# EAGLE design GDEnvSensorNode_1_4h (EAGLE 9.2.0)
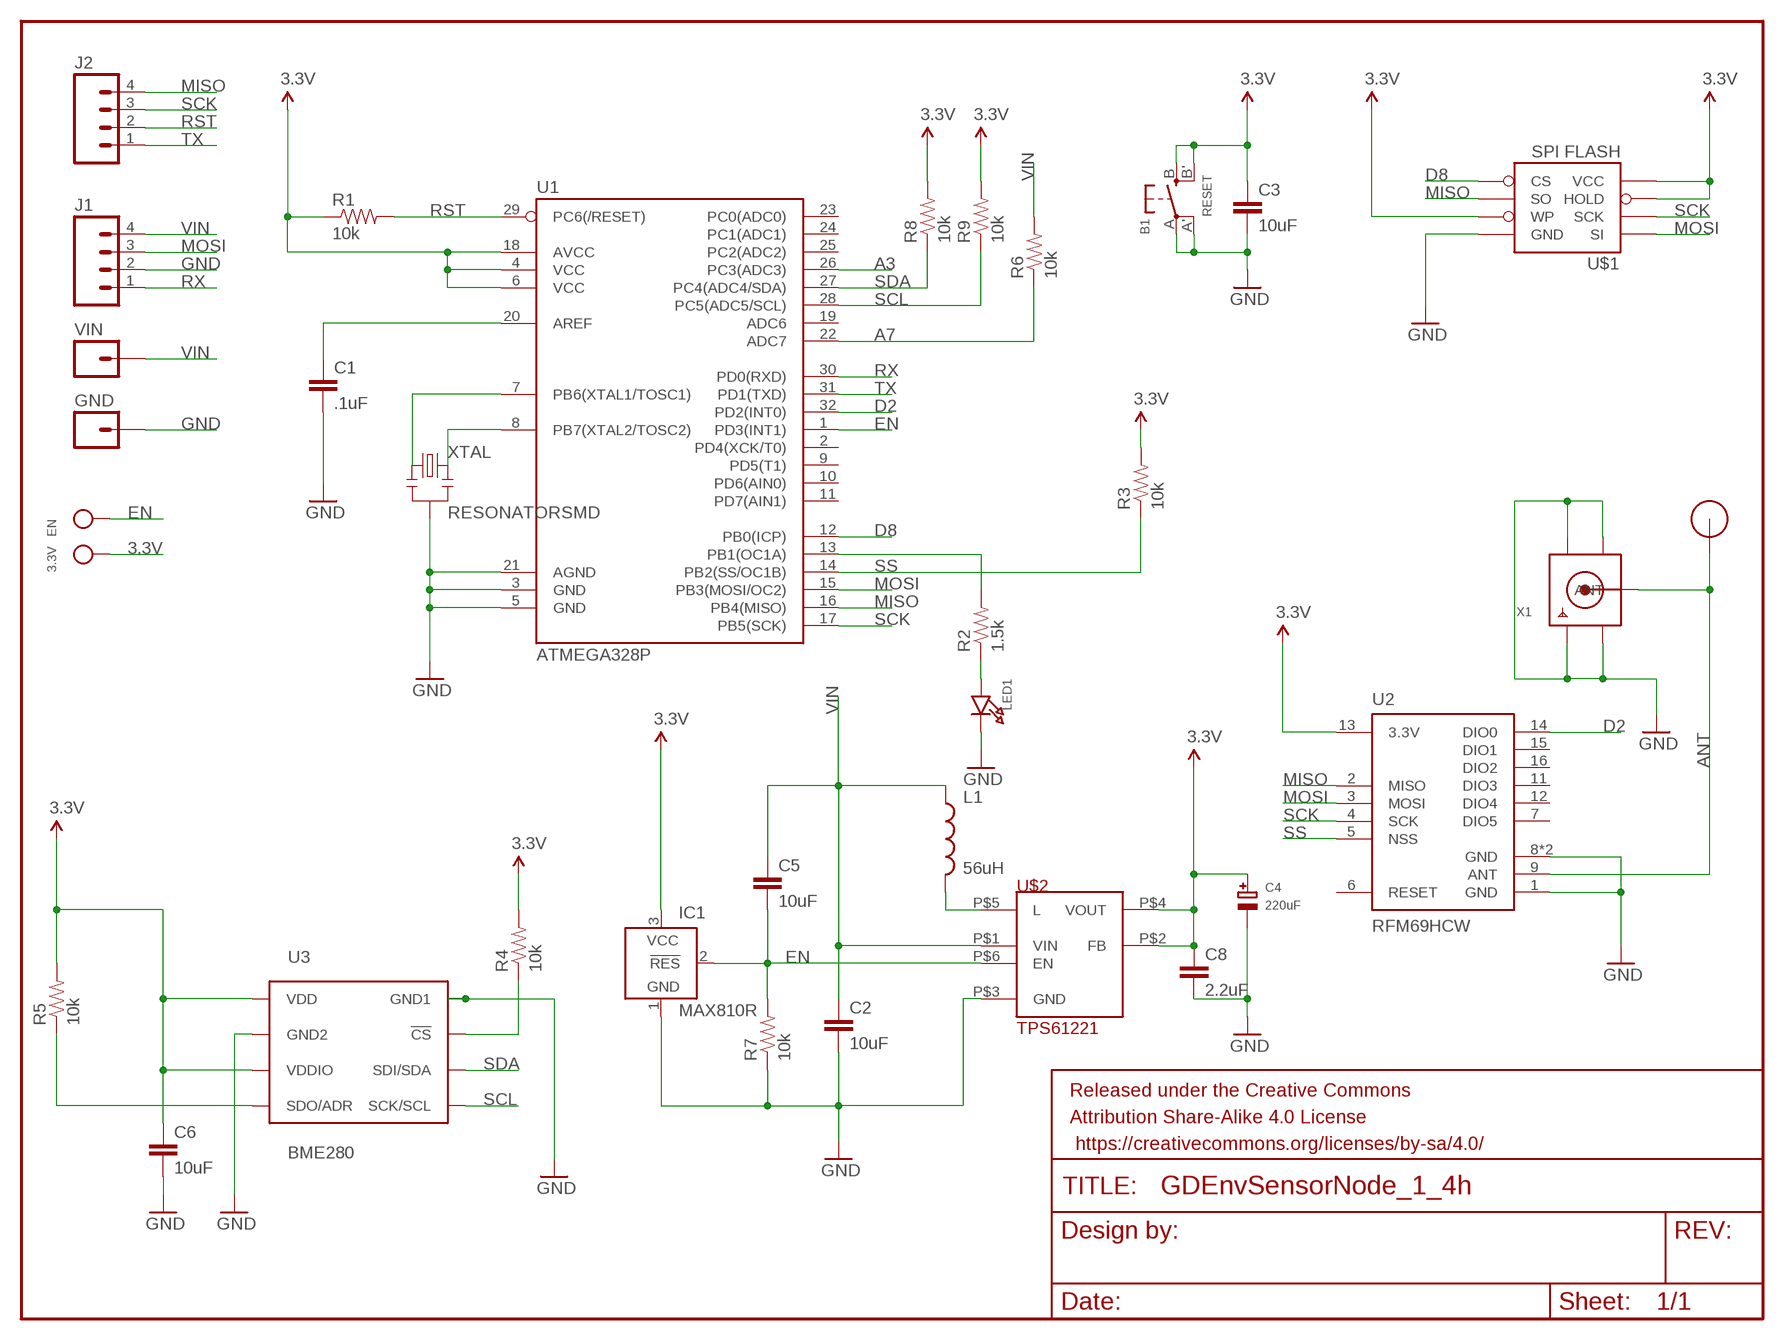
[diagram p0: schematic, sheet 1]

## Parts
3.3V  TESTPOINTROUND1MM  [TESTPOINT_ROUND_1MM]
B1  RESET  SWITCH_TACT_SMT4.6X2.8  [BTN_KMR2_4.6X2.8]
C1  .1uF  CAP0805  [0805]
C2  10uF  CAP0805  [0805]
C3  10uF  CAP0805  [0805]
C4  220uF  CAP_TANTALUMD/7343_REFLOW  [EIA7343-31/D-R]
C5  10uF  CAP0805  [0805]
C6  10uF  CAP0805  [0805]
C8  2.2uF  CAP0805  [0805]
EN  TESTPOINTROUND1MM  [TESTPOINT_ROUND_1MM]
FRAME1  FRAME-LETTER  [CREATIVE_COMMONS]
GND  M01PTH_2MM  [1X01_2MM]
IC1  MAX810R  TCM809  [SOT23B-3]
J1  M04PTH  [1X04]
J2  M04PTH  [1X04]
L1  56uH  INDUCTOR3MM  [3MM]
LED1  LED0805  [CHIPLED_0805]
R1  10k  RESISTOR0805-RES  [0805]
R2  1.5k  RESISTOR0805-RES  [0805]
R3  10k  RESISTOR0805-RES  [0805]
R4  10k  RESISTOR0805-RES  [0805]
R5  10k  RESISTOR0805-RES  [0805]
R6  10k  RESISTOR0805-RES  [0805]
R7  10k  RESISTOR0805-RES  [0805]
R8  10k  RESISTOR0805-RES  [0805]
R9  10k  RESISTOR0805-RES  [0805]
U1  ATMEGA328P  ATMEGA328P_TQFP  [TQFP32-08]
U2  RFM69HCW  [RFM69HCW-XXXS2]
U3  BME280  [BME280_LGA]
U$1  SPI FLASH  AT25F512BJEDEC_3.9MM  [SO08]
U$2  TPS61221  [TPS61221]
U$4  RFM12B_ANTENNA  [RFM12B-ANTENNA]
VIN  M01PTH_2MM  [1X01_2MM]
X1  SMACONNECTOR_EDGE_UFL  [SMA_EDGELAUNCH_UFL]
XTAL  RESONATORSMD  [RESONATOR-SMD]

## Nets
3.3V: 3.3V.P$1 B1.B'(S1) B1.B(S) C3.1 C4.+ C6.1 C8.1 IC1.3(VCC) R1.1 R3.2 R4.2 R5.2 R8.2 R9.2 U1.4(VCC) U1.6(VCC) U1.18(AVCC) U2.13(3.3V) U3.P$6(VDDIO) U3.P$8(VDD) U$1.3_WP(WP) U$1.7_HOLD(HOLD) U$1.8_VCC(VCC) U$2.P$2(FB) U$2.P$4(VOUT)
A3: U1.26(PC3(ADC3))
A7: R6.1 U1.22(ADC7)
ANT: U2.9(ANT) U$4.P$1 X1.P(ANT)
D2: U1.32(PD2(INT0)) U2.14(DIO0)
D8: U1.12(PB0(ICP)) U$1.1_CS(CS)
EN: C5.2 EN.P$1 IC1.2(!RES) R7.2 U1.1(PD3(INT1)) U$2.P$6(EN)
GND: B1.A'(P1) B1.A(P) C1.2 C2.2 C3.2 C4.- C6.2 C8.2 GND.1 IC1.1(GND) J1.2 LED1.C R7.1 U1.3(GND) U1.5(GND) U1.21(AGND) U2.1(GND) U2.8(GND) U2.10(GND) U3.P$1(GND1) U3.P$7(GND2) U$1.4_GND(GND) U$2.P$3(GND) X1.GND@1(GND1) X1.GND@2(GND2) X1.GND@3(GND3) X1.GND@4(GND4) XTAL.2
L: L1.P$2 U$2.P$5(L)
MISO: J2.4 U1.16(PB4(MISO)) U2.2(MISO) U$1.2_SO(SO)
MOSI: J1.3 U1.15(PB3(MOSI/OC2)) U2.3(MOSI) U$1.5_SI(SI)
N$1: U1.8(PB7(XTAL2/TOSC2)) XTAL.3
N$2: U1.7(PB6(XTAL1/TOSC1)) XTAL.1
N$3: LED1.A R2.1
N$5: R4.1 U3.P$2(!CS)
N$8: R2.2 U1.13(PB1(OC1A))
N$13: C1.1 U1.20(AREF)
N$17: R5.1 U3.P$5(SDO/ADR)
RST: J2.2 R1.2 U1.29(PC6(/RESET))
RX: J1.1 U1.30(PD0(RXD))
SCK: J2.3 U1.17(PB5(SCK)) U2.4(SCK) U$1.6_SCK(SCK)
SCL: R9.1 U1.28(PC5(ADC5/SCL)) U3.P$4(SCK/SCL)
SDA: R8.1 U1.27(PC4(ADC4/SDA)) U3.P$3(SDI/SDA)
SS: R3.1 U1.14(PB2(SS/OC1B)) U2.5(NSS)
TX: J2.1 U1.31(PD1(TXD))
VIN: C2.1 C5.1 J1.4 L1.P$1 R6.2 U$2.P$1(VIN) VIN.1
Unconnected: U1.2(PD4(XCK/T0)) U1.9(PD5(T1)) U1.10(PD6(AIN0)) U1.11(PD7(AIN1)) U1.19(ADC6) U1.23(PC0(ADC0)) U1.24(PC1(ADC1)) U1.25(PC2(ADC2)) U2.6(RESET) U2.7(DIO5) U2.11(DIO3) U2.12(DIO4) U2.15(DIO1) U2.16(DIO2)

## Library data of the parts
3.3V EN = microbuilder:TESTPOINT: Test Point Various test points for characterisation and PCB testing TESTPOINT_SMT - Compact Surface Mount Test Point [Digikey: 5016KTR-ND]
B1 = microbuilder:SWITCH_TACT_SMT: SMT Tact Switches 6x6mm - Digikey: P12940SCT-ND KMR2 (4.6x2.8mm) - Digikey: 401-1426-1-ND EVQ-PQHB55 - Light Touch, 160GF (4.5x4.5mm) - Digikey: P8090SCT-ND
C1-C3 C5 C6 C8 = SparkFun-Capacitors:CAP: Capacitor Standard 0603 ceramic capacitor, and 0.1" leaded capacitor.
C4 = GDTech:CAP_TANTALUM: Tantalum Capacitors Wave footprints have larger pads and are meant to be used for hand soldering. Reflow footprints are optimised for solder paste and a reflow oven. EIA3216-18/A-[R/W] - Size A / 3216-18 / 1206 footprint 4.7µF 25V 10% Tantalum Capacitor 10µF 16V 10% Tantalum Capacitor [Digikey: 495-2236-2-ND] EIA3528-21/B-[R/W] - Size B / 3528-21 47µF 10V 10% Tantalum Capactior [Digikey: 495-2216-1-ND] EIA6032-28/C-[R/W] - Size C / 6032-28 10µF 35V 20% Tantalum Capacitor [Digikey: 495-2285-1-ND] 100µF 16V 10% Tantalum Capactior [Digikey: 399-5214-1-ND]
FRAME1 = SparkFun-Aesthetics:FRAME-LETTER: Schematic Frame Standard 8.5x11 US Letter frame
GND VIN = SparkFun-Connectors:M01: Header 1 Standard 1-pin 0.1" header. Use with straight break away headers (SKU : PRT-00116), right angle break away headers (PRT-00553), swiss pins (PRT-00743), machine pins (PRT-00117), and female headers (PRT-00115). SMTSO-256-ET is a "flush mount" nut for a 4-40 screw. The older package used to be too tight, and did not allow it to sit properly thru the drill hit. The latest (0.165DIA) fits nice and snug.
IC1 = telcom:TCM809: POWER SUPPLY MONITOR replacement for Maxim MAX809 and MAX810; MF: MICROCHIP; MPN: TCM809MENB713; OC_FARNELL: 9762744; OC_NEWARK: 96K3998
J1 J2 = SparkFun-Connectors:M04: Header 4 Standard 4-pin 0.1" header. Use with straight break away headers (SKU : PRT-00116), right angle break away headers (PRT-00553), swiss pins (PRT-00743), machine pins (PRT-00117), and female headers (PRT-00115). Molex polarized connector foot print use with SKU : PRT-08231 with associated crimp pins and housings. 1MM SMD Version SKU: PRT-10208; PROD_ID: CONN-09696
L1 = GDTech:INDUCTOR: Inductors Basic Inductor/Choke - 0603 and 1206. Footprints are not proven and vary greatly between part numbers. INDUCTOR POWER 3.3UH 4.0A SMD 0.197" L x 0.197" W x 0.177" H (5.00mm x 5.00mm x 4.50mm)
LED1 = microbuilder:LED: LED 0603 - 0603 Surface Mount Package 2mA: Green LED - Low Power (3.9mcd, 2ma, 1.7Vf) - Digikey: 475-2709-2-ND Orange LED - Low Power (9.8mcd, 2ma, 1.8Vf) - Digikey: 475-1194-2-ND Red LED - Low Power (5mcd, 2ma, 1.8Vf) - Digikey: 475-1195-2-ND Yellow LED - Low Power (7mcd, 2ma, 1.8Vf) - Digikey: 475-1196-2-ND 5mA: Blue LED - Low Power (17mcd, 5ma, 2.9Vf) - Digikey: LNJ937W8CRACT-ND 0805 - 0805 Surface Mount Package 2mA: Red LED (8.8mcd, 2mA, 1.8Vf, Clear) - Low Power [Digikey: 475-2510-1-ND] Green LED (5mcd, 2mA, 1.8Vf, Clear) - Low Power [Digikey: 475-2730-1-ND] Yellow LED (11.3mcd, 2mA, 1.8Vf, Clear) - Low Power [Digikey: 475-2555-1-ND] 20mA: Red LED (104mcd, 20mA, Diffused) - LS R976 [Digikey: 475-1278-6-ND] Red LED (12mcd, 20mA, 2.0Vf, Clear) - APT2012EC [Digikey: 754-1128-1-ND] Green LED (15mcd, 20mA, 2.2Vf, Clear) - APT2012GC [Digikey: 754-1131-1-ND] Orange LED (160mcd, 20mA, 2.1Vf, Clear) - APT2012SECK [Digikey: 754-1130-1-ND] 1206 - 1206 Surface Mount Package Green LED (26mcd, 20mA, Diffused) - LG N971 [Digikey: 475-1407-6-ND] Red LED (15mcd, 20mA, Diffused) - LH N974 [Digikey: 475-1416-6-ND]
R1-R9 = SparkFun-Passives:RESISTOR: Resistor Basic schematic elements and footprints for 0603, 1206, and PTH resistors.
U1 = SparkFun-DigitalIC:ATMEGA328P_TQFP; PROD_ID: IC-09069; VALUE: ATMEGA328P_TQFP
U2 = SparkFun-RF:RFM69H; PROD_ID: IC-11997, IC-12053
U3 = BME280ComponentLibrary:BME280; PROD_ID: IC-13090
U$1 = LowPowerLab:AT25F512B: 4-Mbit SPI flash memory
U$2 = GDTech:TPS61221; AVAILABILITY: Unavailable; DESCRIPTION: the tps6122x family devices provide a power-supply solution for products powered by either a single-cell two-cell or ...; MF: Texas Instruments; MP: TPS61221; PACKAGE: SC-70 Texas Instruments; PRICE: None
U$4 = LowPowerLab:RFM12B_ANTENNA
X1 = adafruit:SMACONNECTOR: SMA Connector 90° DIP SMA Connector, 50 Ohm (4UConnector: 07259)
XTAL = GDTech:RESONATOR: Resonator Small SMD resonator. This is the itty bitty 10/20MHz resonators with built in caps. CSTCE10M0G55 and CSTCE20M0V53. Footprint has been reviewed closely but hasn't been tested yet.

## Board
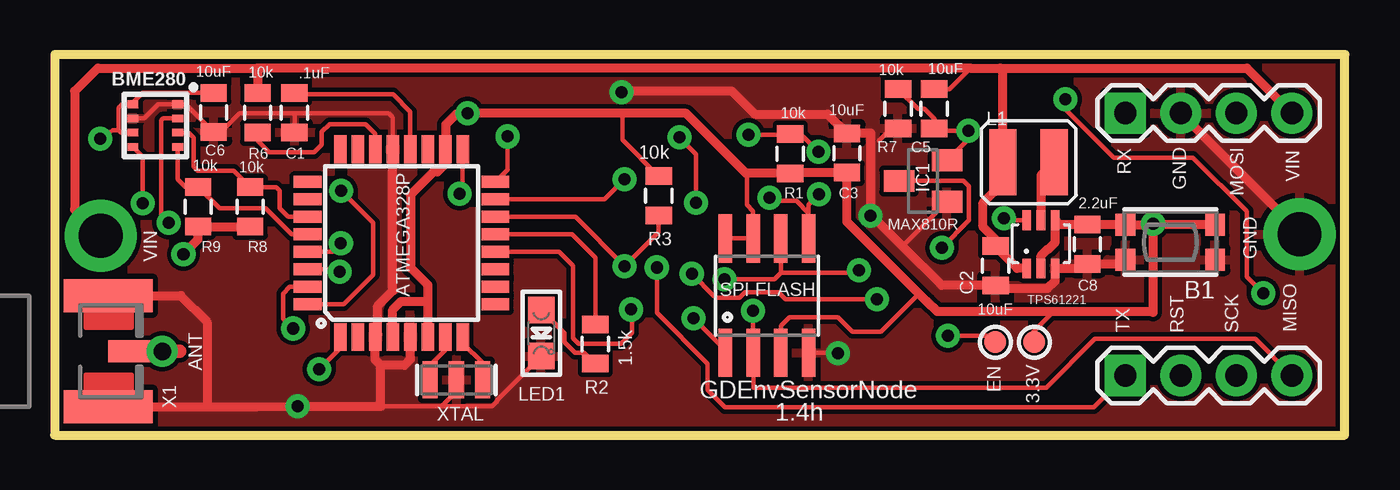
[diagram p1: board, top side]
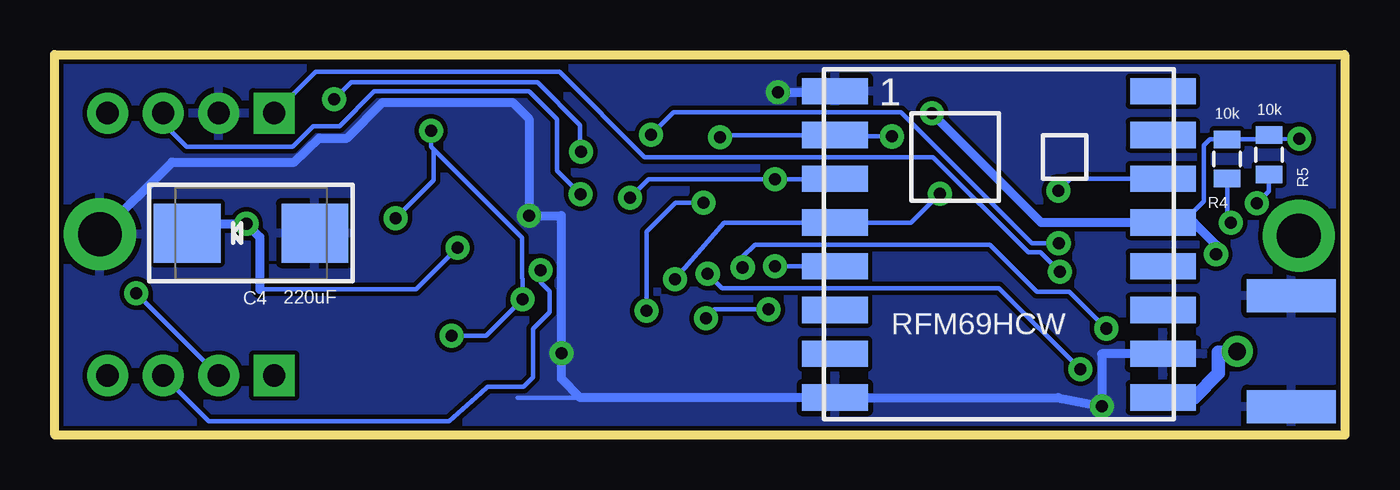
[diagram p2: board, bottom side, seen from below]

Size 59.01 x 17.4 mm. Coordinates in mm from the lower left corner, seen from the top.
Outline: 0,0 59,0 59.01,17.4 0.01,17.4 0,0
Copper layers (1*16): Top 0.035mm / dielectric 1.5mm / Bottom 0.035mm
Design rules "SparkFun *": minimum track width 8mil, minimum drill 20mil, track to track 8mil, track to pad 8mil, pad to pad 8mil, via to via 8mil, smd to smd 8mil, copper to edge 8mil, drill to drill 8mil, minimum pad ring 12mil, minimum via ring 10mil, stop-mask expansion 4mil, vias tented up to drill 22mil, thermal gap 10mil

### Footprints (pad centres in the part's own frame; a part is rotated, then mirrored left to right if it is on the bottom)
TESTPOINT_ROUND_1MM = smd 1 x 1: P$1 0,0
BTN_KMR2_4.6X2.8 = smd 0.9 x 1: A 2.05,0.8; A' -2.05,0.8; B 2.05,-0.8; B' -2.05,-0.8
0805 = smd 0.8 x 1.2: 1 -0.9,0; 2 0.9,0
EIA7343-31/D-R = smd 3.048 x 2.7: + 2.921,0; - -2.921,0
1X01_2MM = drill 2 pad 3.302: 1 0,0
SOT23B-3 = smd 1 x 1.4: 1 -0.95,-1.1; 2 0.95,-1.1; 3 0,1.1
1X04 = drill 1.016 pad 1.88 square: 1 0,0 | drill 1.016 pad 1.88: 2 2.54,0; 3 5.08,0; 4 7.62,0
3MM = smd 1.25 x 3: P$1 -1.17,0; P$2 1.17,0
CHIPLED_0805 = smd 1.2 x 1.2: A 0,-1.05; C 0,1.05
TQFP32-08 = smd 1.27 x 0.559: 1 -4.293,2.8; 2 -4.293,2; 3 -4.293,1.2; 4 -4.293,0.4; 5 -4.293,-0.4; 6 -4.293,-1.2; 7 -4.293,-2; 8 -4.293,-2.8; 17 4.293,-2.8; 18 4.293,-2; 19 4.293,-1.2; 20 4.293,-0.4; 21 4.293,0.4; 22 4.293,1.2; 23 4.293,2; 24 4.293,2.8 | smd 0.559 x 1.27: 9 -2.8,-4.293; 10 -2,-4.293; 11 -1.2,-4.293; 12 -0.4,-4.293; 13 0.4,-4.293; 14 1.2,-4.293; 15 2,-4.293; 16 2.8,-4.293; 25 2.8,4.293; 26 2,4.293; 27 1.2,4.293; 28 0.4,4.293; 29 -0.4,4.293; 30 -1.2,4.293; 31 -2,4.293; 32 -2.8,4.293
RFM69HCW-XXXS2 = smd 3 x 1.2: 1 -7.5,7; 2 -7.5,5; 3 -7.5,3; 4 -7.5,1; 5 -7.5,-1; 6 -7.5,-3; 7 -7.5,-5; 8 -7.5,-7; 9 7.5,-7; 10 7.5,-5; 11 7.5,-3; 12 7.5,-1; 13 7.5,1; 14 7.5,3; 15 7.5,5; 16 7.5,7
BME280_LGA = smd 0.5 x 0.35: P$1 1.025,0.975; P$2 1.025,0.325; P$3 1.025,-0.325; P$4 1.025,-0.975; P$5 -1.025,-0.975; P$6 -1.025,-0.325; P$7 -1.025,0.325; P$8 -1.025,0.975
SO08 = smd 0.61 x 2.21: 1_CS -1.905,-2.616; 2_SO -0.635,-2.616; 3_WP 0.635,-2.616; 4_GND 1.905,-2.616; 5_SI 1.905,2.616; 6_SCK 0.635,2.616; 7_HOLD -0.635,2.616; 8_VCC -1.905,2.616
TPS61221 = smd 0.9 x 0.4: P$1 0,0; P$2 0,-0.65; P$3 0,-1.3; P$4 2.2,-1.3; P$5 2.2,-0.65; P$6 2.2,0
RFM12B-ANTENNA = drill 0.8 pad 1.422: P$1 0,0
SMA_EDGELAUNCH_UFL = smd 4.064 x 1.524: GND@1 2.032,-2.54; GND@2 2.032,2.54 | smd 4.064 x 1.524 bottom: GND@3 2.032,2.54; GND@4 2.032,-2.54 | smd 2.032 x 1.016: P 3.048,0
RESONATOR-SMD = smd 0.7 x 1.7: 1 -1.2,0; 2 0,0; 3 1.2,0

### Placement (x,y rotation side)
3.3V  44.8,4.26 0 top
B1  51.02,8.83 180 top
C1  10.97,14.74 270 top
C2  43.03,7.75 270 top
C3  36.23,12.9 90 top
C4  50.03,9.24 180 bottom
C5  40.23,14.93 270 top
C6  7.27,14.76 270 top
C8  47.23,8.74 270 top
EN  43.02,4.26 0 top
FRAME1  21.56,-9.71 0 top  (outside the outline)
GND  56.94,9.19 0 top
IC1  39.72,11.63 90 top
J1  48.97,14.73 0 top
J2  48.97,2.73 0 top
L1  44.54,12.48 0 top
LED1  22.26,4.67 180 top
R1  33.64,12.87 90 top
R2  24.73,4.17 90 top
R3  27.63,10.95 90 top
R4  5.38,12.63 90 bottom
R5  3.47,12.82 90 bottom
R6  9.28,14.74 90 top
R7  38.58,14.93 90 top
R8  8.94,10.44 270 top
R9  6.56,10.45 270 top
U1  15.87,8.79 90 top
U2  15.82,8.72 0 bottom
U3  4.6,14.16 0 top
U$1  32.58,6.38 0 top
U$2  44.46,7.63 90 top
U$4  4.92,3.84 270 top
VIN  2.11,9.12 0 top
X1  0.41,3.84 0 top
XTAL  18.37,2.53 0 top

### Tracks (layer width: path | path; a pad name or v marks a point on that pad's centre or on a via)
3.3V  (via drill 0.55 pad 1.1)
  Top 0.203: U3.P$8 3.51,15.13 | 3.51,15.13 3.09,15.13 2.93,14.98 2.93,13.95 | 2.93,13.95 3.05,13.83 3.06,13.83 U3.P$6 | C6.1 4.03,15.66 3.51,15.13 | v2.09,13.55 2.65,13.95 2.93,13.95 | U$1.8_VCC U$1.7_HOLD 31.95,10.24 31.66,10.53 31.66,11.94 31.62,11.97 | R3.2 25.97,13.51 25.97,14.72 | U$1.3_WP 33.21,5.01 33.6,5.4 35.82,5.4 36.48,4.74 37.79,4.74 39.52,6.47 | 3.3V.P$1 44.77,4.26 44.77,4.73 45.69,5.65 | IC1.3 41.57,11.63 41.83,11.37 41.83,9.83 v40.58,8.58
  Top 0.406: U$2.P$2 45.11,8.21 45.39,8.49 45.42,8.49 45.76,8.83 U$2.P$4 45.95,9.64 C8.1 B1.B 50.2,9.63 v50.24,9.67 | v50.24,9.67 50.24,5.61 50.2,5.65 45.69,5.65 40.37,5.65 39.9,6.11 | 39.9,6.11 39.52,6.47 | 17.06,6.09 U1.6 | U1.4 15.46,5.73 15.85,6.12 17.03,6.12 17.06,6.09 | 17.06,6.09 17.06,6.87 16.28,7.65 16.28,10.99 17.33,12.04 17.51,12.04 17.86,12.39 U1.18 17.89,13.1 17.89,14.2 18.41,14.72 v18.88,14.72 25.97,14.72 28.88,14.72 31.62,11.97 R1.1 33.67,12 C3.1 36.23,9.77 39.9,6.11 | v5.89,8.28 6.56,8.95 R9.2 R8.2 | B1.B' 50.28,9.63 v50.24,9.67
  Bottom 0.203: U2.13 7.43,9.72 6.46,10.7 6.46,13.25 6.18,13.53 R4.2 3.48,13.53 | 3.48,13.53 R5.2 | 3.48,13.53 v2.09,13.55 | 49.63,6.67 42.48,6.67 v40.58,8.58
  Bottom 0.406: v18.88,14.72 13.88,9.72 U2.13 6.9,9.72 5.87,8.69 5.87,8.3 v5.89,8.28 | C4.+ 52.52,9.67 v50.24,9.67 49.63,9.06 49.63,6.67
A7
  Top 0.203: U1.22 14.67,13.79 14.23,14.23 12.57,14.23 12.22,13.88 12.22,13.28 11.87,12.93 9.82,12.93 9.28,13.47 R6.1
ANT
  Top 0.61: X1.P 5.72,3.84 U$4.P$1
  Bottom 0.61: U2.9 6.89,1.73 5.78,2.84 5.78,3.79 U$4.P$1
D2  (via drill 0.55 pad 1.1)
  Top 0.203: v13.11,11.18 14.57,9.72 14.57,7.33 13.22,5.98 U1.32
  Bottom 0.203: U2.14 12.57,11.72 v13.11,11.18
D8  (via drill 0.55 pad 1.1)
  Top 0.203: U1.12 23.07,8.38 23.72,7.74 23.72,4.43 23.97,4.18 25.91,4.18 26.41,4.68 26.41,5.7 v26.36,5.75 | v29.22,5.35 30.67,3.9 U$1.1_CS
  Bottom 0.203: v26.36,5.75 28.82,5.75 v29.22,5.35
EN  (via drill 0.55 pad 1.1)
  Top 0.203: U1.1 13.07,3.98 v12.1,3.01 | v29.14,7.38 30.15,6.36 30.2,6.36 30.29,6.28 31.31,6.28 31.58,6.54 33.1,6.54 33.42,6.22 v37.61,6.22 | EN.P$1 42.73,4.55 v40.86,4.55 | U$2.P$6 43.51,9.83 v43.42,9.92 | IC1.2 41.79,13.54 v41.79,13.92 40.34,13.92 C5.2 40.23,14.47 39.77,14.93 39.48,14.93 R7.2
  Bottom 0.203: v12.1,3.01 15.81,6.73 28.49,6.73 v29.14,7.38 | v40.86,4.55 39.28,4.55 v37.61,6.22 37.61,7.16 37.64,7.19 37.64,9.04 41.69,13.09 | v41.79,13.92 41.79,13.19 41.69,13.09 | 41.69,13.09 41.69,11.65 v43.42,9.92
GND  (via drill 0.55 pad 1.1)
  Top 0.203: U3.P$7 4.09,14.48 4.74,15.13 U3.P$1 5.99,15.13 C6.2 7.6,13.86 8.46,14.72 10.97,14.72 | XTAL.2 18.37,2.01 17.69,1.33 | 17.69,1.33 15.61,1.33 14.91,1.32 | LED1.C 20.23,1.59 20.23,1.56 20,1.33 17.69,1.33 | U$1.4_GND 35.81,3.77 v35.83,3.75 | IC1.1 38.78,8.64 | U1.21 15.46,14.54 15.27,14.73 15.26,14.72 10.97,14.72 | C1.2 10.97,14.72 | R7.1 38.26,14.03 37.7,13.47
  Top 0.406: GND.1 56.94,9.29 51.54,14.69 51.54,14.7 J1.2 | U1.5 16.27,3.47 16,3.2 14.91,3.2 | 14.91,3.2 14.66,3.45 14.67,3.46 U1.3 14.78,4.61 14.78,5.91 15.46,6.6 U1.21 | 14.91,3.2 14.9,3.19 14.91,1.32 v11.12,1.32 9.2,1.3 6.97,1.3 | X1.GND@1 6.97,1.3 | X1.GND@2 5.77,6.38 6.97,5.18 6.97,1.3 | v25.92,15.69 25.95,15.72 30.99,15.72 32.02,14.69 35.35,14.69 C3.2 36.24,13.81 37.32,13.81 v37.32,10.04 37.38,10.04 38.78,8.64 40.57,6.85 C2.2 43.15,6.71 45.41,6.71 45.76,7.05 U$2.P$3 47.02,7.63 C8.2 48.78,7.84 B1.A
  Bottom 0.203: 37.83,1.73 34.26,1.73
  Bottom 0.406: U2.10 11.12,3.73 v11.12,1.32 13.12,1.73 U2.8 34.26,1.73 34.97,1.73 35.83,2.58 v35.83,3.75 35.83,10.04 v37.32,10.04 37.32,14.46 38.07,15.21 44.01,15.21 45.64,13.58 46.91,13.58 48.05,12.49 53.64,12.49 GND.1 | v25.92,15.69 23.36,15.69 U2.1
  pour Bottom: 0.06,17.44 59.06,17.44 59,0 0,0
  pour Top: 0.06,17.42 59.06,17.42 59.03,0.02 0.03,0.02
L
  Top 0.406: U$2.P$5 45.11,11.88 L1.P$2
MISO  (via drill 0.55 pad 1.1)
  Top 0.203: U1.16 20.72,12.15 v20.72,13.66 | v28.57,13.62 29.34,12.86 v29.34,10.62 | v31.93,5.68 31.93,3.78 U$1.2_SO 31.97,3.74 31.97,2.18 45.35,2.18 47.58,4.41 54.91,4.41 J2.4
  Bottom 0.203: v20.72,13.66 23.25,13.66 U2.2 28.47,13.72 v28.57,13.62 | v29.34,10.62 30.62,10.62 31.93,9.31 v31.93,5.68
MOSI  (via drill 0.55 pad 1.1)
  Top 0.203: U1.15 25.15,10.79 v26.07,11.7 | v32.69,10.86 32.84,10.71 33.93,10.71 34.48,10.15 U$1.5_SI 34.48,10.55 v34.96,11.03
  Bottom 0.203: U2.3 23.34,11.7 v26.07,11.7 31.85,11.7 v32.69,10.86 | J1.3 54.05,14.26 52.97,13.18 48.13,13.18 47.18,14.13 45.98,14.13 44.39,15.72 37.31,15.72 36.04,14.45 36.04,12.1 v34.96,11.03
N$1
  Top 0.203: U1.8 18.66,4.21 19.57,3.31 XTAL.3
N$2
  Top 0.203: U1.7 17.86,3.9 17.17,3.2 XTAL.1
N$3
  Top 0.203: R2.1 24.71,3.27 24.21,3.77 23.8,3.77 23.31,4.26 23.31,4.67 LED1.A
N$5  (via drill 0.55 pad 1.1)
  Top 0.203: v5.21,9.72 4.88,10.05 4.88,14.41 4.96,14.49 4.96,14.48 U3.P$2
  Bottom 0.203: R4.1 5.38,9.9 v5.21,9.72
N$8
  Top 0.203: U1.13 23.67,9.19 24.74,8.12 24.73,8.11 R2.2
N$13
  Top 0.203: C1.1 11.04,15.58 15.47,15.58 16.27,14.79 U1.20
N$17  (via drill 0.55 pad 1.1)
  Top 0.203: v4.02,10.61 4.02,12.74 U3.P$5
  Bottom 0.203: R5.1 3.48,11.15 v4.02,10.61
RST  (via drill 0.55 pad 1.1)
  Top 0.203: U1.29 12.71,8.38 v13.09,8.77 | v31.73,13.73 33.32,13.73 R1.2 34.24,13.64 v34.93,12.96 | v46.22,15.36 46.22,14.91 48.45,12.69 52.06,12.69 54.52,10.23 54.52,7.25 v55.28,6.49
  Bottom 0.203: v13.09,8.77 14.31,8.77 20.3,14.76 30.7,14.76 v31.73,13.73 | v46.22,15.36 45.46,16.13 36.92,16.13 34.97,14.18 34.97,13 v34.93,12.96 | v55.28,6.49 v55.27,6.49 J2.2
RX  (via drill 0.55 pad 1.1)
  Top 0.203: U1.30 12.92,7.58 v13.04,7.46
  Bottom 0.203: v13.04,7.46 13.94,8.36 14.48,8.36 18.83,12.72 32.03,12.72 35.93,16.62 47.08,16.62 J1.1
SCK  (via drill 0.55 pad 1.1)
  Top 0.203: U1.17 18.66,11.2 v18.52,11.05 | v30.64,7.13 32.93,7.14 33.21,7.42 | 33.21,7.42 U$1.6_SCK | 33.21,7.42 36.67,7.42 v36.79,7.54
  Bottom 0.203: v18.52,11.05 19.84,9.72 U2.4 28.39,9.72 v30.64,7.13 | v36.79,7.54 36.79,7 36.38,6.59 36.38,5.63 37.13,4.88 37.13,2.66 37.56,2.23 39.21,2.23 39.53,1.91 40.97,0.65 51.97,0.65 J2.3
SCL
  Top 0.203: U3.P$4 5.63,11.7 5.99,11.34 6,11.35 R9.1 7.54,10.37 9.66,10.37 10.85,9.19 U1.28
SDA
  Top 0.203: U3.P$3 6.12,13.83 6.35,13.61 6.35,12.28 6.53,12.1 8.18,12.1 8.87,11.41 R8.1 10.14,11.34 10.29,11.19 10.29,10.37 10.68,9.98 U1.27
SS  (via drill 0.55 pad 1.1)
  Top 0.203: U1.14 23.81,9.98 v26.07,7.73 27.63,9.29 R3.1
  Bottom 0.203: v26.07,7.73 v26.06,7.72 U2.5
TX  (via drill 0.55 pad 1.1)
  Top 0.203: U1.31 10.76,6.79 10.45,6.48 10.45,5.33 v10.9,4.88 | v27.54,7.67 27.54,5.6 29.86,3.28 29.86,2.08 30.66,1.28 47.52,1.28 J2.1
  Bottom 0.203: v10.9,4.88 12.59,6.57 14.08,6.57 16.23,8.72 26.97,8.72 27.54,8.15 v27.54,7.67
VIN
  Top 0.203: C5.1 40.92,15.83 41.88,16.79
  Top 0.406: U$2.P$1 44.03,7.63 C2.1 43.03,8.95 42.46,9.52 42.46,10.62 43.37,11.53 L1.P$1 43.37,16.66 43.24,16.79 | J1.4 54.53,16.79 43.24,16.79 | 9.28,16.79 1.97,16.79 0.91,15.73 0.91,10.32 VIN.1 | 43.24,16.79 41.88,16.79 9.28,16.79 | 9.28,16.79 R6.2

### Text on the board
tPlace: RX | GND | MOSI | VIN | TX | RST | SCK | MISO
tNames: GDEnvSensorNode | 1.4h